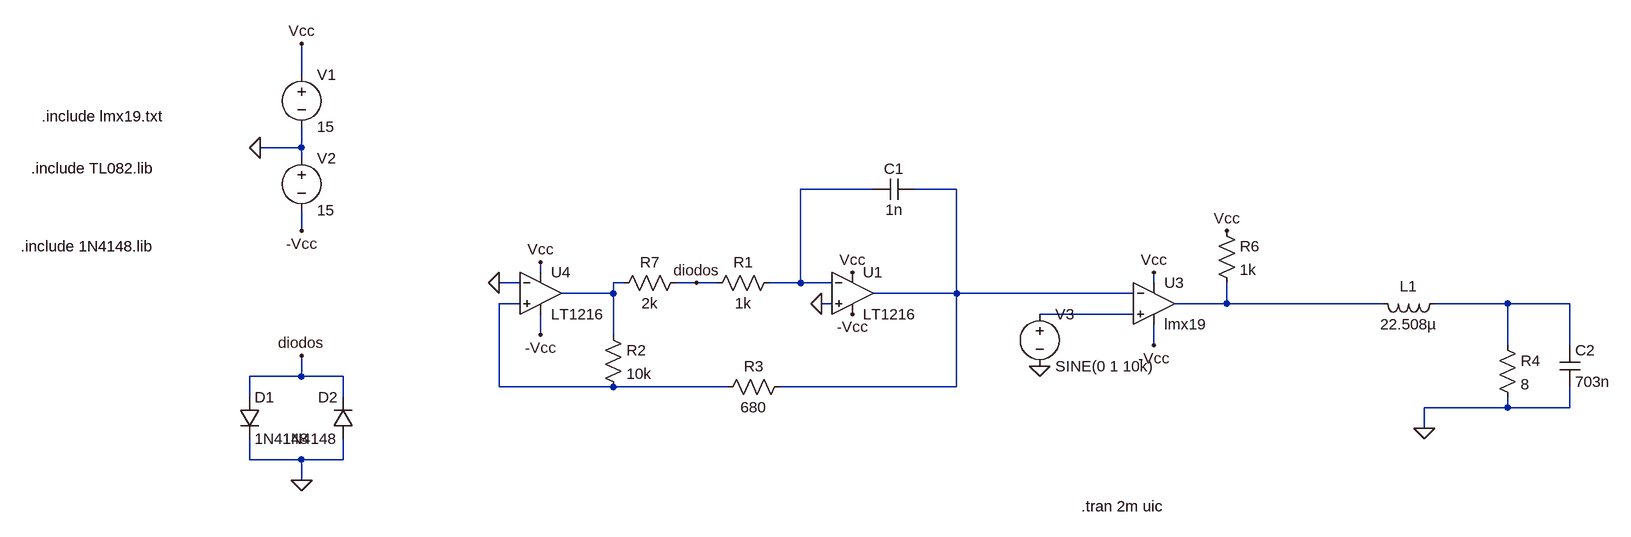
[diagram p0: schematic entrada-150k.asc]
entrada-150k.asc, the LTspice schematic file:
Version 4
SHEET 1 3644 1844
WIRE -336 -16 -336 -64
WIRE -336 96 -336 64
WIRE -336 96 -400 96
WIRE -336 112 -336 96
WIRE 544 160 432 160
WIRE 672 160 608 160
WIRE -336 224 -336 192
WIRE 32 288 32 272
WIRE 0 304 -32 304
WIRE 160 304 144 304
WIRE 272 304 240 304
WIRE 304 304 272 304
WIRE 432 304 432 160
WIRE 432 304 384 304
WIRE 480 304 432 304
WIRE 976 304 976 288
WIRE 144 320 144 304
WIRE 144 320 64 320
WIRE 672 320 672 160
WIRE 672 320 544 320
WIRE 944 320 672 320
WIRE 0 336 -32 336
WIRE 480 336 464 336
WIRE 1088 336 1088 304
WIRE 1088 336 1008 336
WIRE 1328 336 1088 336
WIRE 1520 336 1408 336
WIRE 1616 336 1520 336
WIRE 944 352 800 352
WIRE 32 384 32 352
WIRE 144 384 144 320
WIRE 976 400 976 368
WIRE 1520 400 1520 336
WIRE 1616 400 1616 336
WIRE -336 448 -336 416
WIRE -336 448 -416 448
WIRE -272 448 -336 448
WIRE -32 464 -32 336
WIRE 144 464 -32 464
WIRE 320 464 144 464
WIRE 672 464 672 320
WIRE 672 464 400 464
WIRE -416 480 -416 448
WIRE -272 480 -272 448
WIRE 1520 496 1520 480
WIRE 1520 496 1392 496
WIRE 1616 496 1616 464
WIRE 1616 496 1520 496
WIRE 1392 528 1392 496
WIRE -416 576 -416 544
WIRE -336 576 -416 576
WIRE -272 576 -272 544
WIRE -272 576 -336 576
WIRE -336 608 -336 576
FLAG -400 96 0
FLAG -336 -64 Vcc
FLAG -336 224 -Vcc
FLAG 32 272 Vcc
FLAG 32 384 -Vcc
FLAG 512 288 Vcc
FLAG 512 352 -Vcc
FLAG 464 336 0
FLAG -32 304 0
FLAG -336 608 0
FLAG -336 416 diodos
FLAG 272 304 diodos
FLAG 976 288 Vcc
FLAG 800 432 0
FLAG 1088 224 Vcc
FLAG 976 400 -Vcc
FLAG 1392 528 0
SYMBOL voltage -336 -32 R0
SYMATTR InstName V1
SYMATTR Value 15
SYMBOL voltage -336 96 R0
SYMATTR InstName V2
SYMATTR Value 15
SYMBOL cap 608 144 R90
WINDOW 0 0 32 VBottom 2
WINDOW 3 32 32 VTop 2
SYMATTR InstName C1
SYMATTR Value 1n
SYMBOL res 400 288 R90
WINDOW 0 0 56 VBottom 2
WINDOW 3 32 56 VTop 2
SYMATTR InstName R1
SYMATTR Value 1k
SYMBOL res 128 368 R0
SYMATTR InstName R2
SYMATTR Value 10k
SYMBOL res 416 448 R90
WINDOW 0 0 56 VBottom 2
WINDOW 3 32 56 VTop 2
SYMATTR InstName R3
SYMATTR Value 680
SYMBOL diode -432 480 R0
SYMATTR InstName D1
SYMATTR Value 1N4148
SYMBOL diode -256 544 R180
WINDOW 0 24 64 Left 2
WINDOW 3 24 0 Left 2
SYMATTR InstName D2
SYMATTR Value 1N4148
SYMBOL res 256 288 R90
WINDOW 0 0 56 VBottom 2
WINDOW 3 32 56 VTop 2
SYMATTR InstName R7
SYMATTR Value 2k
SYMBOL Opamps\\LT1216 32 256 R0
SYMATTR InstName U4
SYMBOL Opamps\\opamp2 976 272 R0
SYMATTR InstName U3
SYMATTR Value lmx19
SYMBOL Opamps\\LT1216 512 256 R0
SYMATTR InstName U1
SYMBOL voltage 800 336 R0
WINDOW 123 0 0 Left 2
WINDOW 39 0 0 Left 2
SYMATTR InstName V3
SYMATTR Value SINE(0 1 10k)
SYMBOL res 1072 208 R0
SYMATTR InstName R6
SYMATTR Value 1k
SYMBOL ind 1424 320 R90
WINDOW 0 5 56 VBottom 2
WINDOW 3 32 56 VTop 2
SYMATTR InstName L1
SYMATTR Value 22.508µ
SYMBOL res 1504 384 R0
SYMATTR InstName R4
SYMATTR Value 8
SYMBOL cap 1600 400 R0
SYMATTR InstName C2
SYMATTR Value 703n
TEXT -752 128 Left 2 !.include TL082.lib
TEXT -768 248 Left 2 !.include 1N4148.lib
TEXT -736 48 Left 2 !.include lmx19.txt
TEXT 864 648 Left 2 !.tran 2m uic

The netlist it stands for:
* entrada-150k.asc
V1 Vcc 0 15
V2 0 -Vcc 15
C1 N002 N001 1n
R1 N001 diodos 1k
R2 N003 N004 10k
R3 N002 N004 680
D1 diodos 0 1N4148
D2 0 diodos 1N4148
R7 diodos N003 2k
XU4 N004 0 Vcc -Vcc N003 LT1216  ; pins In+ In- V+ V- OUT
XU3 N007 N002 Vcc -Vcc N005 lmx19  ; pins In+ In- V+ V- OUT
XU1 0 N001 Vcc -Vcc N002 LT1216  ; pins In+ In- V+ V- OUT
V3 N007 0 SINE(0 1 10k)
R6 Vcc N005 1k
L1 N006 N005 22.508µ
R4 N006 0 8
C2 N006 0 703n
.model D D
.lib standard.dio
.include TL082.lib
.include 1N4148.lib
.include lmx19.txt
.tran 2m uic
.backanno
.end